# EAGLE design SmartLEDShield_T4toT3Adapter_V1 (EAGLE 9.6.1)
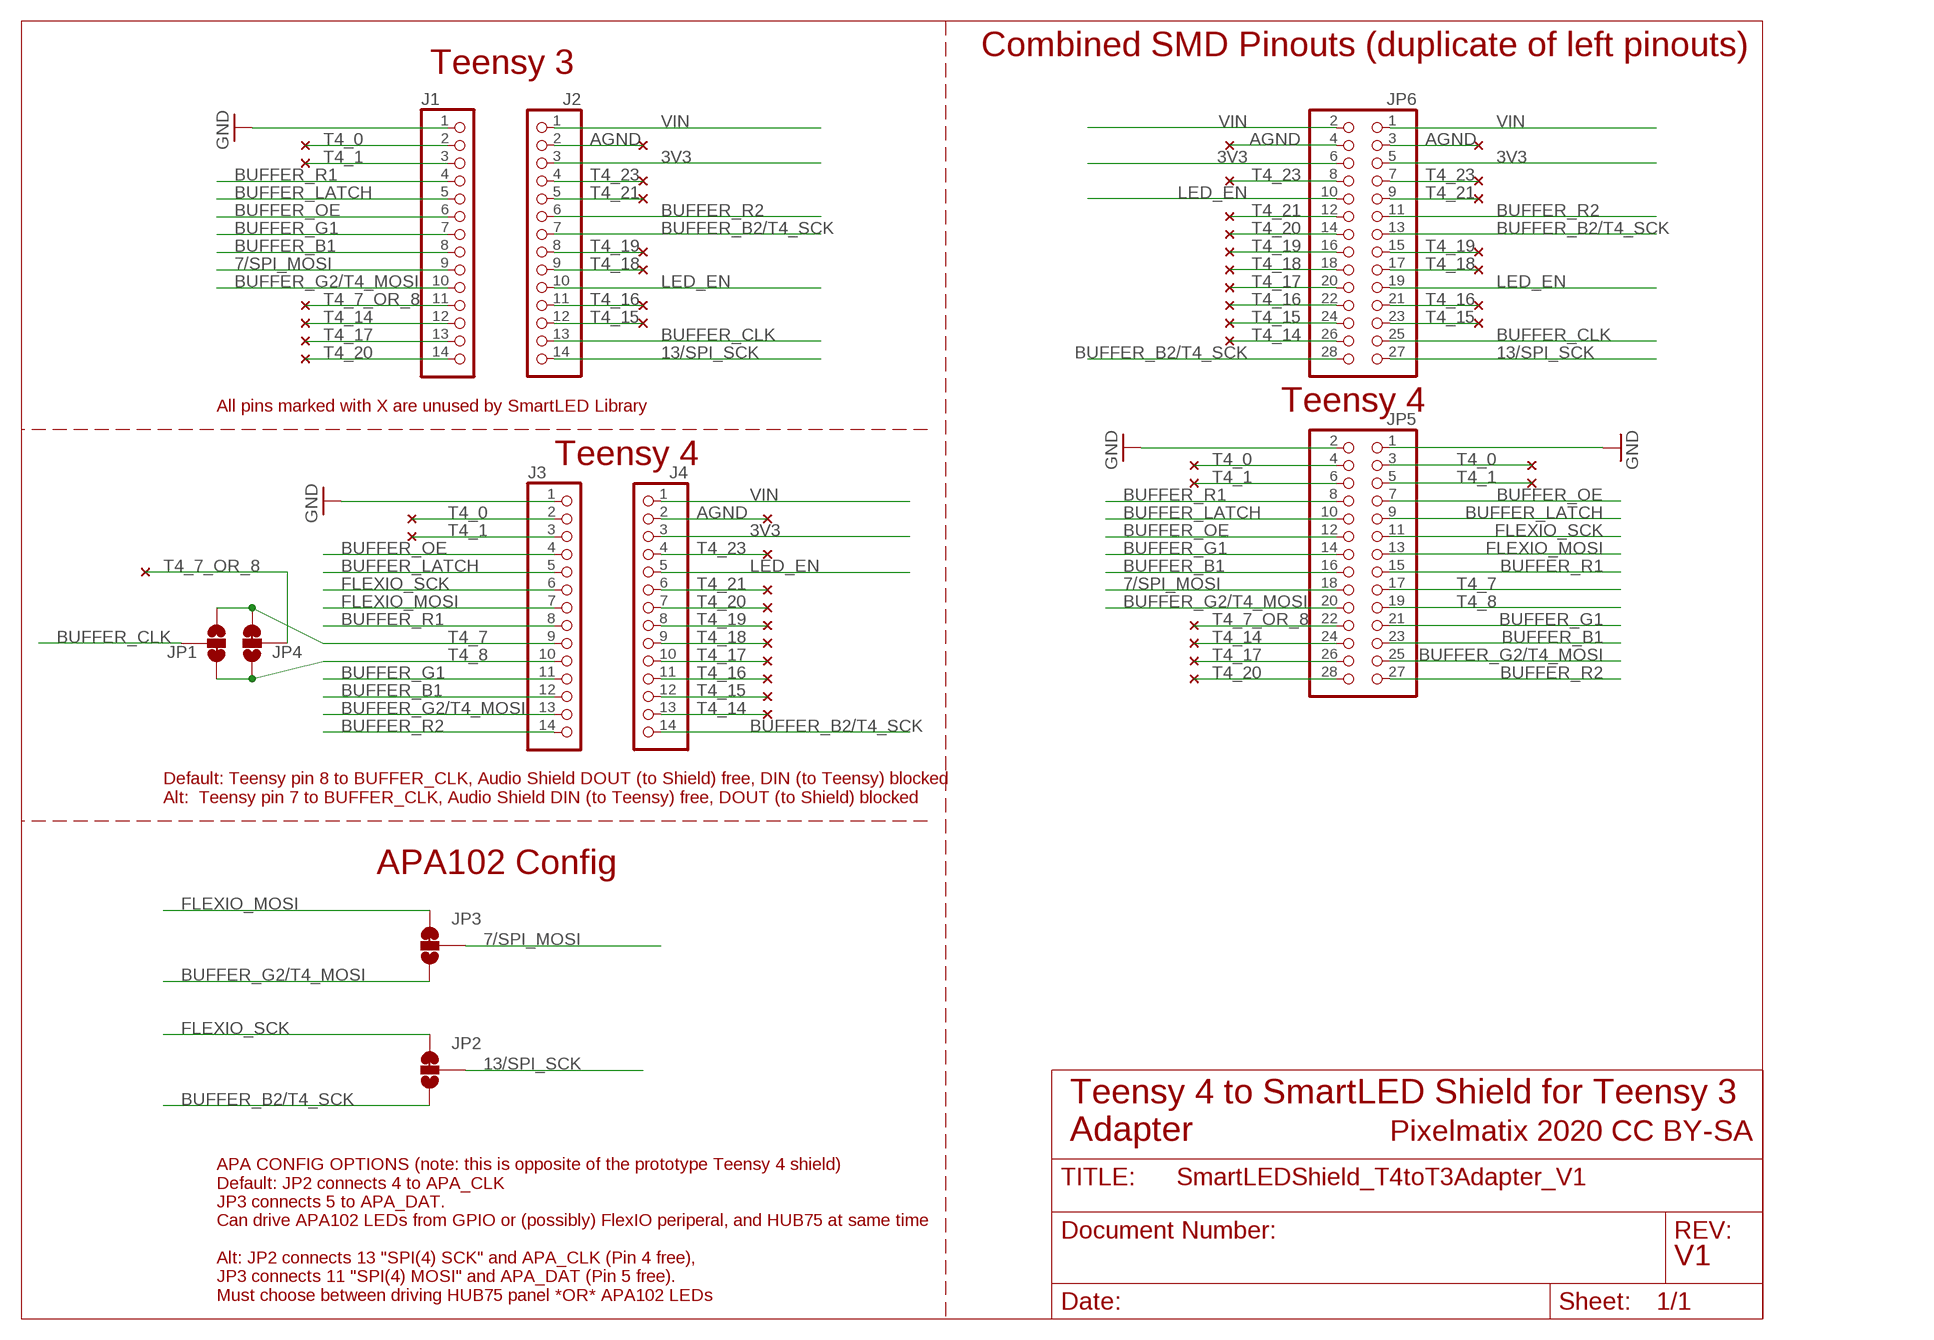
[diagram p0: schematic, sheet 1]

## Parts
J1  PINHD-1X14_2.54-S  [1X14-S]
J2  PINHD-1X14_2.54-S  [1X14-S]
J3  PINHD-1X14_2.54-S  [1X14-S]
J4  PINHD-1X14_2.54-S  [1X14-S]
JP1  JUMPER-SMT_3_1-NC_TRACE_SILK  [SMT-JUMPER_3_1-NC_TRACE_SILK]
JP2  JUMPER-SMT_3_1-NC_TRACE_SILK  [SMT-JUMPER_3_1-NC_TRACE_SILK]
JP3  JUMPER-SMT_3_1-NC_TRACE_SILK  [SMT-JUMPER_3_1-NC_TRACE_SILK]
JP4  JUMPER-SMT_3_1-NC_TRACE_SILK  [SMT-JUMPER_3_1-NC_TRACE_SILK]
JP5  PINHD-2X14_2.54-SMD  [2X14SMD]
JP6  PINHD-2X14_2.54-SMD  [2X14SMD]
U$1  NC  (no package)
U$2  NC  (no package)
U$3  NC  (no package)
U$4  NC  (no package)
U$5  NC  (no package)
U$6  NC  (no package)
U$7  NC  (no package)
U$8  NC  (no package)
U$9  NC  (no package)
U$10  NC  (no package)
U$11  NC  (no package)
U$12  NC  (no package)
U$13  NC  (no package)
U$14  NC  (no package)
U$15  NC  (no package)
U$16  NC  (no package)
U$17  NC  (no package)
U$18  NC  (no package)
U$19  NC  (no package)
U$20  NC  (no package)
U$21  NC  (no package)
U$22  NC  (no package)
U$23  NC  (no package)
U$24  NC  (no package)
U$25  NC  (no package)
U$26  NC  (no package)
U$27  NC  (no package)
U$28  NC  (no package)
U$29  NC  (no package)
U$30  NC  (no package)
U$31  NC  (no package)
U$32  NC  (no package)
U$33  NC  (no package)
U$34  NC  (no package)
U$35  NC  (no package)
U$36  NC  (no package)
U$37  NC  (no package)
U$38  NC  (no package)
U$39  NC  (no package)
U$40  NC  (no package)
U$41  NC  (no package)
U$42  NC  (no package)
U$43  NC  (no package)
U$44  NC  (no package)
U$45  NC  (no package)
U$46  NC  (no package)
U$47  NC  (no package)
U$48  NC  (no package)
U$49  NC  (no package)
U$50  NC  (no package)
U$51  NC  (no package)

## Nets
3V3 [power]: J2.3 J4.3 JP6.5 JP6.6
7/SPI_MOSI: J1.9 JP3.2 JP5.18
13/SPI_SCK: J2.14 JP2.2 JP6.27
AGND: J2.2 J4.2 JP6.3 JP6.4 U$8.P$1 U$16.P$1 U$33.P$1 U$42.P$1
BUFFER_B1: J1.8 J3.12 JP5.16 JP5.23
BUFFER_B2/T4_SCK: J2.7 J4.14 JP2.1 JP6.13 JP6.28
BUFFER_CLK: J2.13 JP1.2 JP6.25
BUFFER_G1: J1.7 J3.11 JP5.14 JP5.21
BUFFER_G2/T4_MOSI: J1.10 J3.13 JP3.1 JP5.20 JP5.25
BUFFER_LATCH: J1.5 J3.5 JP5.9 JP5.10
BUFFER_OE: J1.6 J3.4 JP5.7 JP5.12
BUFFER_R1: J1.4 J3.8 JP5.8 JP5.15
BUFFER_R2: J2.6 J3.14 JP5.27 JP6.11
FLEXIO_MOSI: J3.7 JP3.3 JP5.13
FLEXIO_SCK: J3.6 JP2.3 JP5.11
GND: J1.1 J3.1 JP5.1 JP5.2
LED_EN: J2.10 J4.5 JP6.10 JP6.19
T4_0: J1.2 J3.2 JP5.3 JP5.4 U$1.P$1 U$5.P$1 U$27.P$1 U$40.P$1
T4_1: J1.3 J3.3 JP5.5 JP5.6 U$4.P$1 U$12.P$1 U$28.P$1 U$41.P$1
T4_7: J3.9 JP1.1 JP4.3 JP5.17
T4_7_OR_8: J1.11 JP4.2 JP5.22 U$6.P$1 U$26.P$1 U$29.P$1
T4_8: J3.10 JP1.3 JP4.1 JP5.19
T4_14: J1.12 J4.13 JP5.24 JP6.26 U$7.P$1 U$25.P$1 U$30.P$1 U$51.P$1
T4_15: J2.12 J4.12 JP6.23 JP6.24 U$14.P$1 U$20.P$1 U$38.P$1 U$46.P$1
T4_16: J2.11 J4.11 JP6.21 JP6.22 U$13.P$1 U$19.P$1 U$37.P$1 U$45.P$1
T4_17: J1.13 J4.10 JP5.26 JP6.20 U$2.P$1 U$24.P$1 U$32.P$1 U$50.P$1
T4_18: J2.9 J4.9 JP6.17 JP6.18 U$11.P$1 U$18.P$1 U$36.P$1 U$44.P$1
T4_19: J2.8 J4.8 JP6.15 JP6.16 U$9.P$1 U$17.P$1 U$35.P$1 U$43.P$1
T4_20: J1.14 J4.7 JP5.28 JP6.14 U$15.P$1 U$23.P$1 U$31.P$1 U$49.P$1
T4_21: J2.5 J4.6 JP6.9 JP6.12 U$10.P$1 U$22.P$1 U$34.P$1 U$48.P$1
T4_23: J2.4 J4.4 JP6.7 JP6.8 U$3.P$1 U$21.P$1 U$39.P$1 U$47.P$1
VIN: J2.1 J4.1 JP6.1 JP6.2

## Notes on the sheet
- Combined SMD Pinouts (duplicate of left pinouts)
- Teensy 3
- All pins marked with X are unused by SmartLED Library | Teensy 4
- Teensy 4
- Default: Teensy pin 8 to BUFFER_CLK, Audio Shield DOUT (to Shield) free, DIN (to Teensy) blocked
  Alt:  Teensy pin 7 to BUFFER_CLK, Audio Shield DIN (to Teensy) free, DOUT (to Shield) blocked
- APA102 Config
- Teensy 4 to SmartLED Shield for Teensy 3
  Adapter
- Pixelmatix 2020 CC BY-SA
- V1
- APA CONFIG OPTIONS (note: this is opposite of the prototype Teensy 4 shield)
  Default: JP2 connects 4 to APA_CLK
  JP3 connects 5 to APA_DAT.
  Can drive APA102 LEDs from GPIO or (possibly) FlexIO periperal, and HUB75 at same time
  
  Alt: JP2 connects 13 "SPI(4) SCK" and APA_CLK (Pin 4 free),
  JP3 connects 11 "SPI(4) MOSI" and APA_DAT (Pin 5 free).
  Must choose between driving HUB75 panel *OR* APA102 LEDs

## Library data of the parts
J1-J4 = pinhead-2:PINHD-1X14: PIN HEADER
JP1-JP4 = SparkFun-Jumpers:JUMPER-SMT_3_1-NC_TRACE: Normally closed trace jumper (1 of 2 connections) This jumper has a trace between two pads so it's normally closed (NC). The other connection is normally open (NO). Use a razor knife to open the connection. For best results follow the IPC guidelines for cutting traces: Cutout at least 0.063 mm (0.005 in). Remove all loose material to clean up the cut area. Seal the cut with an approved epoxy. Reapply solder to reclose the connection, or to close the NO connection.
JP5 JP6 = pinhead-2:PINHD-2X14: PIN HEADER
U$1-U$51 = eclibrary:NC

## Net classes
0 default: width 0.254 mm
1 power: width 0.406 mm

## Board
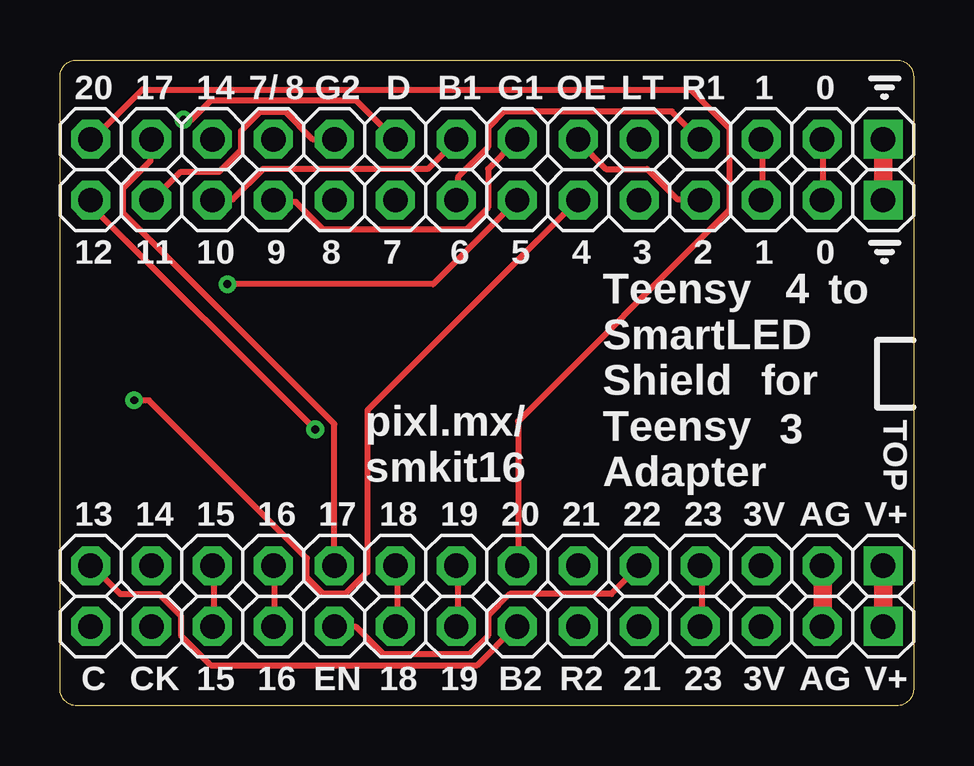
[diagram p1: board, top side]
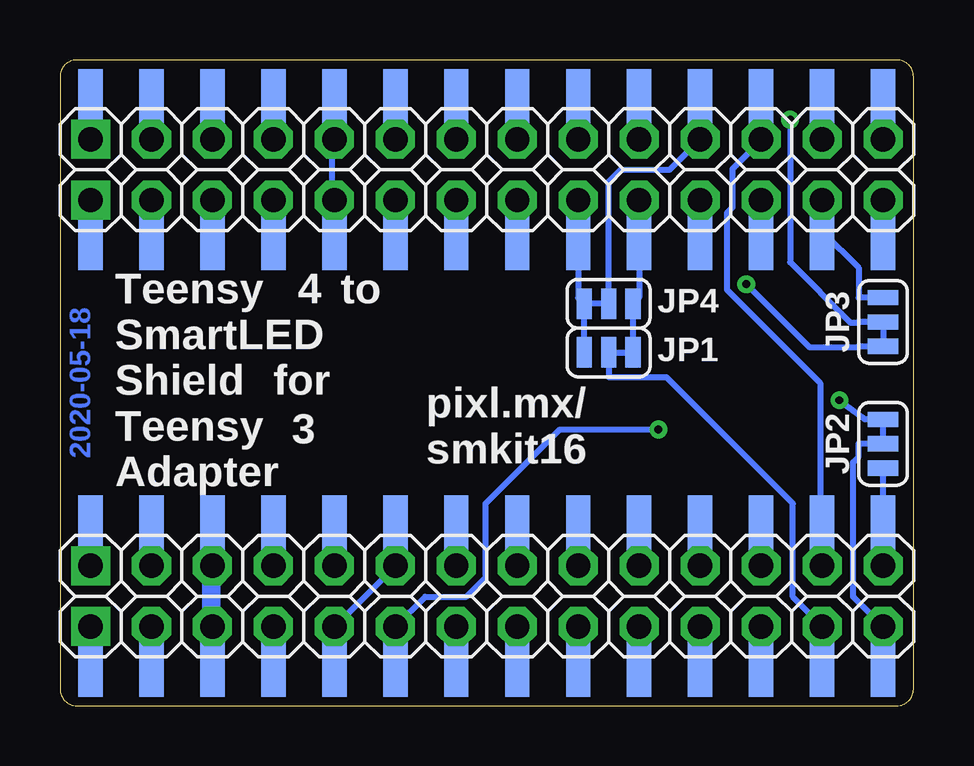
[diagram p2: board, bottom side, seen from below]

Size 35.57 x 26.93 mm. Coordinates in mm from the lower left corner, seen from the top.
Outline: 0.76,26.93 34.8,26.93 arc-100 35.56,26.16 35.56,0.76 arc-100 34.8,0 0.76,0 arc-100 0,0.76 0,26.16 arc-100 0.76,26.93
Outline: 0.76,26.93 4.83,26.93
Copper layers (1*16): Top 0.0356mm / dielectric 1.5011mm / Bottom 0.0356mm
Design rules "OshParkMod-8mil-20150316 *": minimum track width 6mil, minimum drill 13mil, track to track 8mil, track to pad 8mil, pad to pad 8mil, via to via 8mil, smd to smd 8mil, copper to edge 15mil, drill to drill 6mil, minimum pad ring 12mil, minimum via ring 8mil, stop-mask expansion 3mil, vias tented up to drill 30mil, thermal gap 10mil

### Footprints (pad centres in the part's own frame; a part is rotated, then mirrored left to right if it is on the bottom)
1X14-S = drill 1.016 square: 1 -16.51,0 | drill 1.016 octagon: 2 -13.97,0; 3 -11.43,0; 4 -8.89,0; 5 -6.35,0; 6 -3.81,0; 7 -1.27,0; 8 1.27,0; 9 3.81,0; 10 6.35,0; 11 8.89,0; 12 11.43,0; 13 13.97,0; 14 16.51,0
SMT-JUMPER_3_1-NC_TRACE_SILK = smd 0.635 x 1.27: 1 -1.016,0; 2 0,0; 3 1.016,0
2X14SMD = smd 1.016 x 3.302: 1 -1.27,-3.81; 2 -1.27,1.27; 3 1.27,-3.81; 4 1.27,1.27; 5 3.81,-3.81; 6 3.81,1.27; 7 6.35,-3.81; 8 6.35,1.27; 9 8.89,-3.81; 10 8.89,1.27; 11 11.43,-3.81; 12 11.43,1.27; 13 13.97,-3.81; 14 13.97,1.27; 15 16.51,-3.81; 16 16.51,1.27; 17 19.05,-3.81; 18 19.05,1.27; 19 21.59,-3.81; 20 21.59,1.27; 21 24.13,-3.81; 22 24.13,1.27; 23 26.67,-3.81; 24 26.67,1.27; 25 29.21,-3.81; 26 29.21,1.27; 27 31.75,-3.81; 28 31.75,1.27

### Placement (x,y rotation side)
J1  17.78,23.62 180 top
J2  17.78,3.3 180 top
J3  17.78,21.08 180 top
J4  17.78,5.84 180 top
JP1  12.7,14.73 0 bottom
JP2  1.27,10.92 90 bottom
JP3  1.27,16 270 bottom
JP4  12.7,16.77 180 bottom
JP5  33.02,23.62 0 bottom
JP6  33.02,5.84 0 bottom

### Tracks (layer width: path | path; a pad name or v marks a point on that pad's centre or on a via)
3V3
  Bottom 0.406: JP6.5 29.26,2.03 29.26,3.29 J2.3 29.26,3.41 | JP6.6 29.26,7.06 29.26,5.92 J4.3 29.26,5.69
  Bottom 0.762: 29.26,5.69 29.26,3.41
7/SPI_MOSI  (via drill 0.33)
  Top 0.254: v5.15,24.44 5.49,24.44 6.29,25.24 12.35,25.24 13.95,23.64 J1.9
  Bottom 0.254: JP3.2 2.29,16 2.4,15.98 2.63,15.98 5.15,18.49 v5.15,24.44 | JP5.18 13.95,24.89 13.95,23.64 J1.9
13/SPI_SCK
  Bottom 0.254: JP2.2 2.29,10.92 2.29,10.38 2.52,10.15 2.52,4.55 1.37,3.41 | 1.37,3.41 J2.14 | 1.37,3.41 JP6.27
AGND
  Top 0.254: 31.78,3.41 J2.2 | 31.78,5.81 J4.2
  Top 0.762: 31.78,5.81 31.78,3.41
  Bottom 0.254: J2.2 31.78,3.29 31.78,2.03 JP6.3 | J4.2 31.78,5.92 31.78,7.06 JP6.4
BUFFER_B1
  Top 0.254: J3.12 6.4,21.12 7.2,21.12 8.46,22.38 15.32,22.38 16.46,23.52 J1.8
  Bottom 0.254: J3.12 6.4,21.01 6.4,19.87 JP5.23 | J1.8 16.58,23.64 16.58,24.89 JP5.16
BUFFER_B2/T4_SCK
  Top 0.254: J2.7 18.98,3.29 17.38,1.69 6.29,1.69 5.03,2.95 5.03,3.75 4.12,4.66 2.52,4.66 1.37,5.81 J4.14
  Bottom 0.254: J2.7 19.09,3.29 19.09,2.03 JP6.13 | JP2.1 1.26,9.81 1.26,7.18 JP6.28 1.37,7.06 1.37,5.92 J4.14
BUFFER_CLK
  Bottom 0.254: JP1.2 12.7,13.72 12.69,13.69 10.29,13.69 5.03,8.44 5.03,4.55 3.89,3.41 | 3.89,3.41 J2.13 | 3.89,3.41 JP6.25
BUFFER_G1
  Top 0.254: J3.11 8.92,21.01 9.83,21.01 10.98,19.87 16.92,19.87 17.83,20.78 17.83,22.38 18.98,23.52 J1.7
  Bottom 0.254: J3.11 8.92,21.01 8.92,19.87 JP5.21 | J1.7 19.09,23.64 19.09,24.89 JP5.14
BUFFER_G2/T4_MOSI
  Top 0.254: J1.10 11.43,23.64 10.52,23.64 9.38,24.78 8.35,24.78 7.55,23.98 7.55,23.18 6.63,22.27 5.03,22.27 3.89,21.12 J3.13
  Bottom 0.254: JP3.1 2.29,17.02 2.29,18.27 3.77,19.75 JP5.25 3.89,19.87 3.89,21.01 J3.13 | JP5.20 J1.10
BUFFER_LATCH
  Bottom 0.254: JP5.9 24.23,19.87 24.23,21.01 J3.5 24.23,21.12 24.23,23.52 J1.5 24.23,23.64 24.23,24.89 JP5.10
BUFFER_OE
  Top 0.254: J3.4 26.63,21.12 25.72,21.12 24.46,22.38 22.75,22.38 21.61,23.52 J1.6
  Bottom 0.254: J3.4 26.75,21.01 26.75,19.87 JP5.7 | J1.6 21.61,23.64 21.61,24.89 JP5.12
BUFFER_R1
  Top 0.254: J3.8 16.58,21.12 16.58,22.04 17.83,23.29 17.83,24.09 18.52,24.78 25.49,24.78 26.63,23.64 J1.4
  Bottom 0.254: J3.8 16.58,21.01 16.58,19.87 JP5.15 | J1.4 26.75,23.64 26.75,24.89 JP5.8
BUFFER_R2  (via drill 0.33)
  Top 0.254: v10.63,11.52 1.37,20.78 1.37,21.01 J3.14
  Bottom 0.254: J3.14 1.37,21.01 1.37,19.87 JP5.27 | JP6.11 21.61,2.03 21.61,3.29 J2.6 20.35,4.55 18.63,4.55 17.83,5.35 17.83,8.44 14.75,11.52 v10.63,11.52
FLEXIO_MOSI  (via drill 0.33)
  Top 0.254: v6.97,17.58 15.55,17.58 J3.7
  Bottom 0.254: JP3.3 2.29,14.99 2.4,14.95 4.35,14.95 v6.97,17.58 | JP5.13 19.09,19.87 19.09,21.01 J3.7
FLEXIO_SCK  (via drill 0.33)
  Top 0.254: v3.09,12.74 3.7,12.74 10.29,6.15 10.29,5.35 10.98,4.66 11.89,4.66 12.8,5.58 12.8,12.32 21.49,21.01 J3.6
  Bottom 0.254: JP2.3 2.02,11.94 v3.09,12.74 | JP5.11 21.61,19.87 21.61,21.01 J3.6
GND
  Top 0.762: J1.1 J3.1
  Bottom 0.254: JP5.1 J3.1 | JP5.2 J1.1
LED_EN
  Top 0.254: J2.10 11.43,3.29 12.35,3.29 13.49,2.15 17.03,2.15 17.83,2.95 17.83,3.75 18.75,4.66 22.98,4.66 24.12,5.81 J4.5
  Bottom 0.254: JP6.19 J2.10 | J4.5 24.23,5.92 24.23,7.06 JP6.10
T4_0
  Top 0.254: J3.2 31.78,21.12 31.78,23.52 J1.2
  Bottom 0.254: J3.2 31.78,21.01 31.78,19.87 JP5.3 | J1.2 31.78,23.64 31.78,24.89 JP5.4
T4_1
  Top 0.254: J3.3 29.26,21.12 29.26,23.52 J1.3
  Bottom 0.254: J3.3 29.26,21.01 29.26,19.87 JP5.5 | J1.3 29.26,23.64 29.26,24.89 JP5.6
T4_7
  Bottom 0.254: JP1.1 JP4.3 13.97,17.02 JP5.17 | J3.9 13.97,19.87 | 13.97,19.87 JP5.17 | JP5.17 13.95,19.87 13.97,19.87
T4_7_OR_8
  Bottom 0.254: JP4.2 12.7,21.85 12.19,22.35 10.16,22.35 J1.11 8.92,23.64 8.92,24.89 JP5.22
T4_8
  Bottom 0.254: JP1.3 JP4.1 11.43,17.02 JP5.19 11.43,19.87 J3.10
T4_14
  Bottom 0.254: J4.13 3.89,5.92 3.89,7.06 JP6.26 3.89,7.18 3.89,13.46 7.77,17.35 7.77,20.55 7.55,20.78 7.55,22.38 6.4,23.52 J1.12 6.4,23.64 6.4,24.89 JP5.24
T4_15
  Top 0.254: J2.12 6.4,3.41 6.4,5.81 J4.12
  Bottom 0.254: J2.12 6.4,3.29 6.4,2.03 JP6.23 | J4.12 6.4,5.92 6.4,7.06 JP6.24
T4_16
  Top 0.254: J2.11 8.92,3.41 8.92,5.81 J4.11
  Bottom 0.254: J2.11 8.92,3.29 8.92,2.03 JP6.21 | J4.11 8.92,5.92 8.92,7.06 JP6.22
T4_17
  Top 0.254: J4.10 11.43,11.75 2.63,20.55 2.63,21.58 3.77,22.72 3.77,23.52 J1.13
  Bottom 0.254: J1.13 3.89,23.64 3.89,24.89 JP5.26 | JP6.20 J4.10
T4_18
  Top 0.254: J2.9 14.06,3.41 14.06,5.81 J4.9
  Bottom 0.254: J2.9 14.06,3.29 14.06,2.03 JP6.17 | J4.9 14.06,5.92 14.06,7.06 JP6.18
T4_19
  Top 0.254: J2.8 16.58,3.41 16.58,5.81 J4.8
  Bottom 0.254: J2.8 16.58,3.29 16.58,2.03 JP6.15 | J4.8 16.58,5.92 16.58,7.06 JP6.16
T4_20
  Top 0.254: J4.7 19.09,5.92 19.09,11.86 27.89,20.67 27.89,24.09 26.29,25.69 3.43,25.69 1.37,23.64 J1.14
  Bottom 0.254: J4.7 19.09,5.92 19.09,7.06 JP6.14 | J1.14 1.37,23.64 1.37,24.89 JP5.28
T4_21
  Bottom 0.254: JP6.12 21.61,7.06 21.61,5.92 J4.6 21.61,5.81 24.12,3.29 J2.5 24.23,3.29 24.23,2.03 JP6.9
T4_23
  Top 0.254: J2.4 26.75,3.41 26.75,5.81 J4.4
  Bottom 0.254: J2.4 26.75,3.29 26.75,2.03 JP6.7 | J4.4 26.75,5.92 26.75,7.06 JP6.8
VIN
  Top 0.762: J4.1 J2.1
  Bottom 0.254: JP6.1 J2.1 | JP6.2 J4.1

### Text on the board
Bottom: 2020-05-18
tPlace: 20 | 17 | 14 | 7 | / | 8 | G2 | D | B1 | G1 | OE | LT | R1 | 1 | 0 | 12 | 11 | 10 | 9 | 8 | 7 | 6 | 5 | 4 | Teensy / SmartLED / Shield / Teensy / Adapter | 3 | 2 | 1 | 4 | 0 | to | for | 3 | TOP | pixl.mx/ / smkit16 | 13 | 14 | 15 | 16 | 17 | 18 | 19 | 20 | 21 | 22 | 23 | 3V | AG | V+ | C | CK | 15 | 16 | EN | 18 | 19 | B2 | R2 | 21 | 23 | 3V | AG | V+
bPlace: to | 4 | Teensy / SmartLED / Shield / Teensy / Adapter | for | pixl.mx/ / smkit16 | 3
Document: Teensy 4 to SmartLED Shield / for Teensy 3 Adapter | Pixelmatix 2020 CC BY-SA